# Altium schematic sheet Top Level.SchDoc
size A4
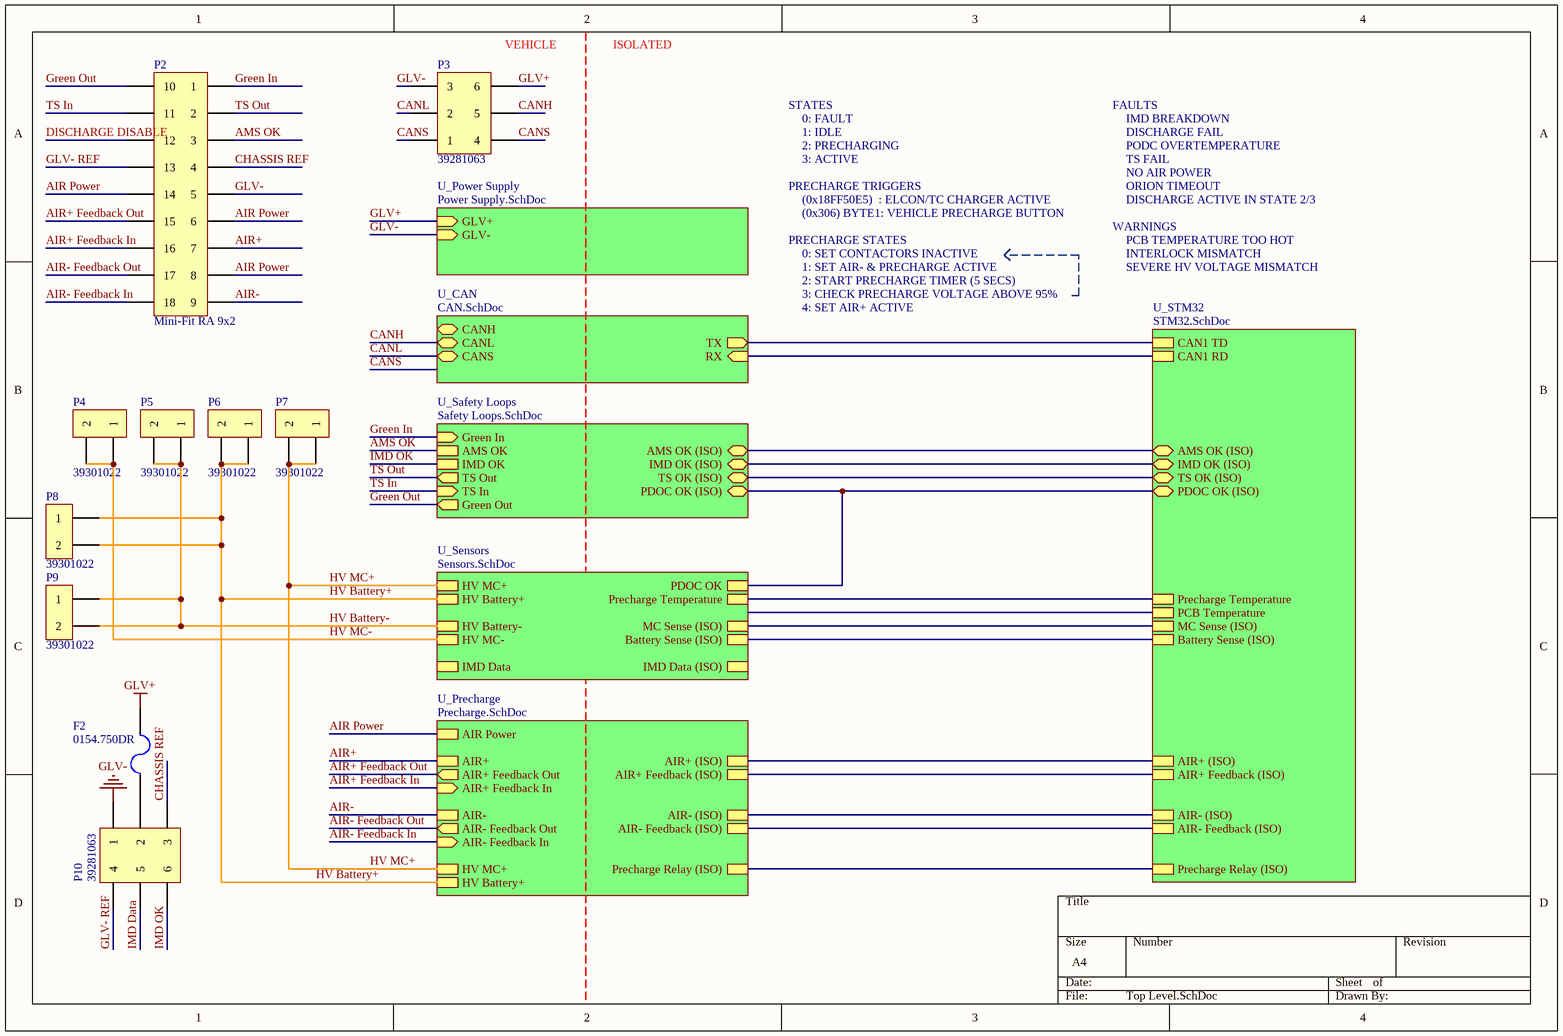
[diagram p0: Top Level.SchDoc]

## Parts
F2  0154.750DR  [Omni BLOK 0154]
P2  Mini-Fit RA 9x2  [39301182]
P3  39281063  [39281063]
P4  39301022  [39301022]
P5  39301022  [39301022]
P6  39301022  [39301022]
P7  39301022  [39301022]
P8  39301022  [39301022]
P9  39301022  [39301022]
P10  39281063  [39281063]

## Sub-sheets
U_CAN = CAN.SchDoc: CANH (bidir), CANL (bidir), CANS (bidir), RX (in), TX (out)
U_Power Supply = Power Supply.SchDoc: GLV+ (in), GLV- (in)
U_Precharge = Precharge.SchDoc: AIR Power, AIR- (ISO), AIR- Feedback Out (out), AIR- Feedback (ISO), AIR-, AIR- Feedback In (in), AIR+, AIR+ Feedback Out (out), AIR+ (ISO), AIR+ Feedback (ISO), AIR+ Feedback In (in), Precharge Relay (ISO), HV MC+, HV Battery+
U_Safety Loops = Safety Loops.SchDoc: AMS OK, IMD OK (ISO) (bidir), AMS OK (ISO) (bidir), PDOC OK (ISO) (bidir), TS OK (ISO) (bidir), Green In (in), IMD OK, TS Out (out), TS In (in), Green Out (out)
U_Sensors = Sensors.SchDoc: PDOC OK, HV MC+, HV Battery+, HV MC-, HV Battery-, Precharge Temperature, MC Sense (ISO), Battery Sense (ISO), IMD Data, IMD Data (ISO)
U_STM32 = STM32.SchDoc: CAN1 RD, CAN1 TD, AIR+ (ISO), AIR+ Feedback (ISO), AIR- (ISO), AIR- Feedback (ISO), Precharge Relay (ISO), AMS OK (ISO) (bidir), IMD OK (ISO) (bidir), TS OK (ISO) (bidir), PDOC OK (ISO) (bidir), Precharge Temperature, PCB Temperature, MC Sense (ISO), Battery Sense (ISO)

## Nets
GLV+: F2.2 P3.6 ; sheet U_Power Supply/GLV+
GLV-: P2.5 P3.3 P10.1 ; sheet U_Power Supply/GLV-
AIR Power: P2.6 P2.8 P2.14 ; sheet U_Precharge/AIR Power
AIR+: P2.7 ; sheet U_Precharge/AIR+
AIR+ Feedback In: P2.16 ; sheet U_Precharge/AIR+ Feedback In
AIR+ Feedback Out: P2.15 ; sheet U_Precharge/AIR+ Feedback Out
AIR-: P2.9 ; sheet U_Precharge/AIR-
AIR- Feedback In: P2.18 ; sheet U_Precharge/AIR- Feedback In
AIR- Feedback Out: P2.17 ; sheet U_Precharge/AIR- Feedback Out
AMS OK: P2.3 ; sheet U_Safety Loops/AMS OK
CANH: P3.5 ; sheet U_CAN/CANL
CANL: P3.2 ; sheet U_CAN/CANS
CANS: P3.1 P3.4
CHASSIS REF: P2.4 P10.3
DISCHARGE DISABLE: P2.12
GLV- REF: P2.13 P10.4
Green In: P2.1 ; sheet U_Safety Loops/Green In
Green Out: P2.10 ; sheet U_Safety Loops/Green Out
HV Battery+: P6.1 P6.2 P8.1 P8.2 ; sheet U_Precharge/HV Battery+, sheet U_Sensors/HV Battery+
HV Battery-: P5.1 P5.2 P9.1 P9.2 ; sheet U_Sensors/HV Battery-
HV MC+: P7.1 P7.2 ; sheet U_Precharge/HV MC+, sheet U_Sensors/HV MC+
HV MC-: P4.1 P4.2 ; sheet U_Sensors/HV MC-
IMD Data: P10.5
IMD OK: P10.6 ; sheet U_Safety Loops/IMD OK
TS In: P2.11 ; sheet U_Safety Loops/TS In
TS Out: P2.2 ; sheet U_Safety Loops/TS Out
NetF2_1: F2.1 P10.2
(unnamed): sheet U_CAN/RX, sheet U_STM32/CAN1 RD
(unnamed): sheet U_CAN/TX, sheet U_STM32/CAN1 TD
(unnamed): sheet U_STM32/AIR+ (ISO), sheet U_Precharge/AIR+ (ISO)
(unnamed): sheet U_STM32/AIR+ Feedback (ISO), sheet U_Precharge/AIR+ Feedback (ISO)
(unnamed): sheet U_STM32/AIR- (ISO), sheet U_Precharge/AIR- (ISO)
(unnamed): sheet U_STM32/AIR- Feedback (ISO), sheet U_Precharge/AIR- Feedback (ISO)
(unnamed): sheet U_STM32/Precharge Relay (ISO), sheet U_Precharge/Precharge Relay (ISO)
(unnamed): sheet U_STM32/AMS OK (ISO), sheet U_Safety Loops/AMS OK (ISO)
(unnamed): sheet U_STM32/IMD OK (ISO), sheet U_Safety Loops/IMD OK (ISO)
(unnamed): sheet U_STM32/TS OK (ISO), sheet U_Safety Loops/TS OK (ISO)
(unnamed): sheet U_STM32/PDOC OK (ISO), sheet U_Safety Loops/PDOC OK (ISO), sheet U_Sensors/PDOC OK
(unnamed): sheet U_STM32/Precharge Temperature, sheet U_Sensors/Precharge Temperature
(unnamed): sheet U_STM32/MC Sense (ISO), sheet U_Sensors/MC Sense (ISO)
(unnamed): sheet U_STM32/Battery Sense (ISO), sheet U_Sensors/Battery Sense (ISO)

## Notes on the sheet
- (near P3) VEHICLE
- ISOLATED
- STATES
- FAULTS
- 0: FAULT
- 1: IDLE
- 2: PRECHARGING
- 3: ACTIVE
- IMD BREAKDOWN
- DISCHARGE FAIL
- PODC OVERTEMPERATURE
- TS FAIL
- NO AIR POWER
- PRECHARGE STATES
- PRECHARGE TRIGGERS
- (0x18FF50E5)  : ELCON/TC CHARGER ACTIVE
- (0x306) BYTE1: VEHICLE PRECHARGE BUTTON
- WARNINGS
- PCB TEMPERATURE TOO HOT
- ORION TIMEOUT
- DISCHARGE ACTIVE IN STATE 2/3
- 1: SET AIR- & PRECHARGE ACTIVE
- 2: START PRECHARGE TIMER (5 SECS)
- 3: CHECK PRECHARGE VOLTAGE ABOVE 95%
- 4: SET AIR+ ACTIVE
- 0: SET CONTACTORS INACTIVE
- INTERLOCK MISMATCH
- SEVERE HV VOLTAGE MISMATCH

## Library data of the parts
F2 = 0154.750DR: FUSE BOARD MNT 750MA 125VAC/VDC; Manufacturer: LittelFuse Inc; Part Number: 0154.750DR; Digikey Part Number: F1221CT-ND; Digikey Link: https://www.digikey.com/product-detail/en/littelfuse-inc/0154.750DR/F1221CT-ND/183370
P2 = 39301182: Positions: 18; Pitch: 4.20mm; Row Spacing: 4.2mm; Angle: 90; Flange: No; Contact: Gold; Part Number: 39301182; Digikey Part Number: WM21371-ND; Digikey Link: https://www.digikey.com/product-detail/en/molex/0039301182/WM21371-ND/930340
P3 P10 = 39281063: Mini-Fit VERT 3x2; Positions: 6; Pitch: 4.20mm; Row Spacing: 4.2mm; Angle: 0; Flange: No; Contact: Gold; Part Number: 39281063; Digikey Part Number: WM3802-ND; Digikey Link: https://www.digikey.com/product-detail/en/molex/0039281063/WM3802-ND/61404
P4-P9 = 39301022: Positions: 2; Pitch: 4.20mm; Row Spacing: 4.2mm; Angle: 90; Flange: No; Contact: Gold; Part Number: 39301022; Digikey Part Number: WM21363-ND; Digikey Link: https://www.digikey.com/product-detail/en/molex/0039301022/WM21363-ND/930332